# EasyEDA schematic SCH_Affordable-Quality-Slime-Project-(AQSP)_2024-12-04.json
TITLE: AQSP BMI270; REV: B1; Date: 2024-11-30; Sheet: 1/1; Drawn By: abillow; Company: Affordable Quality Slime Project
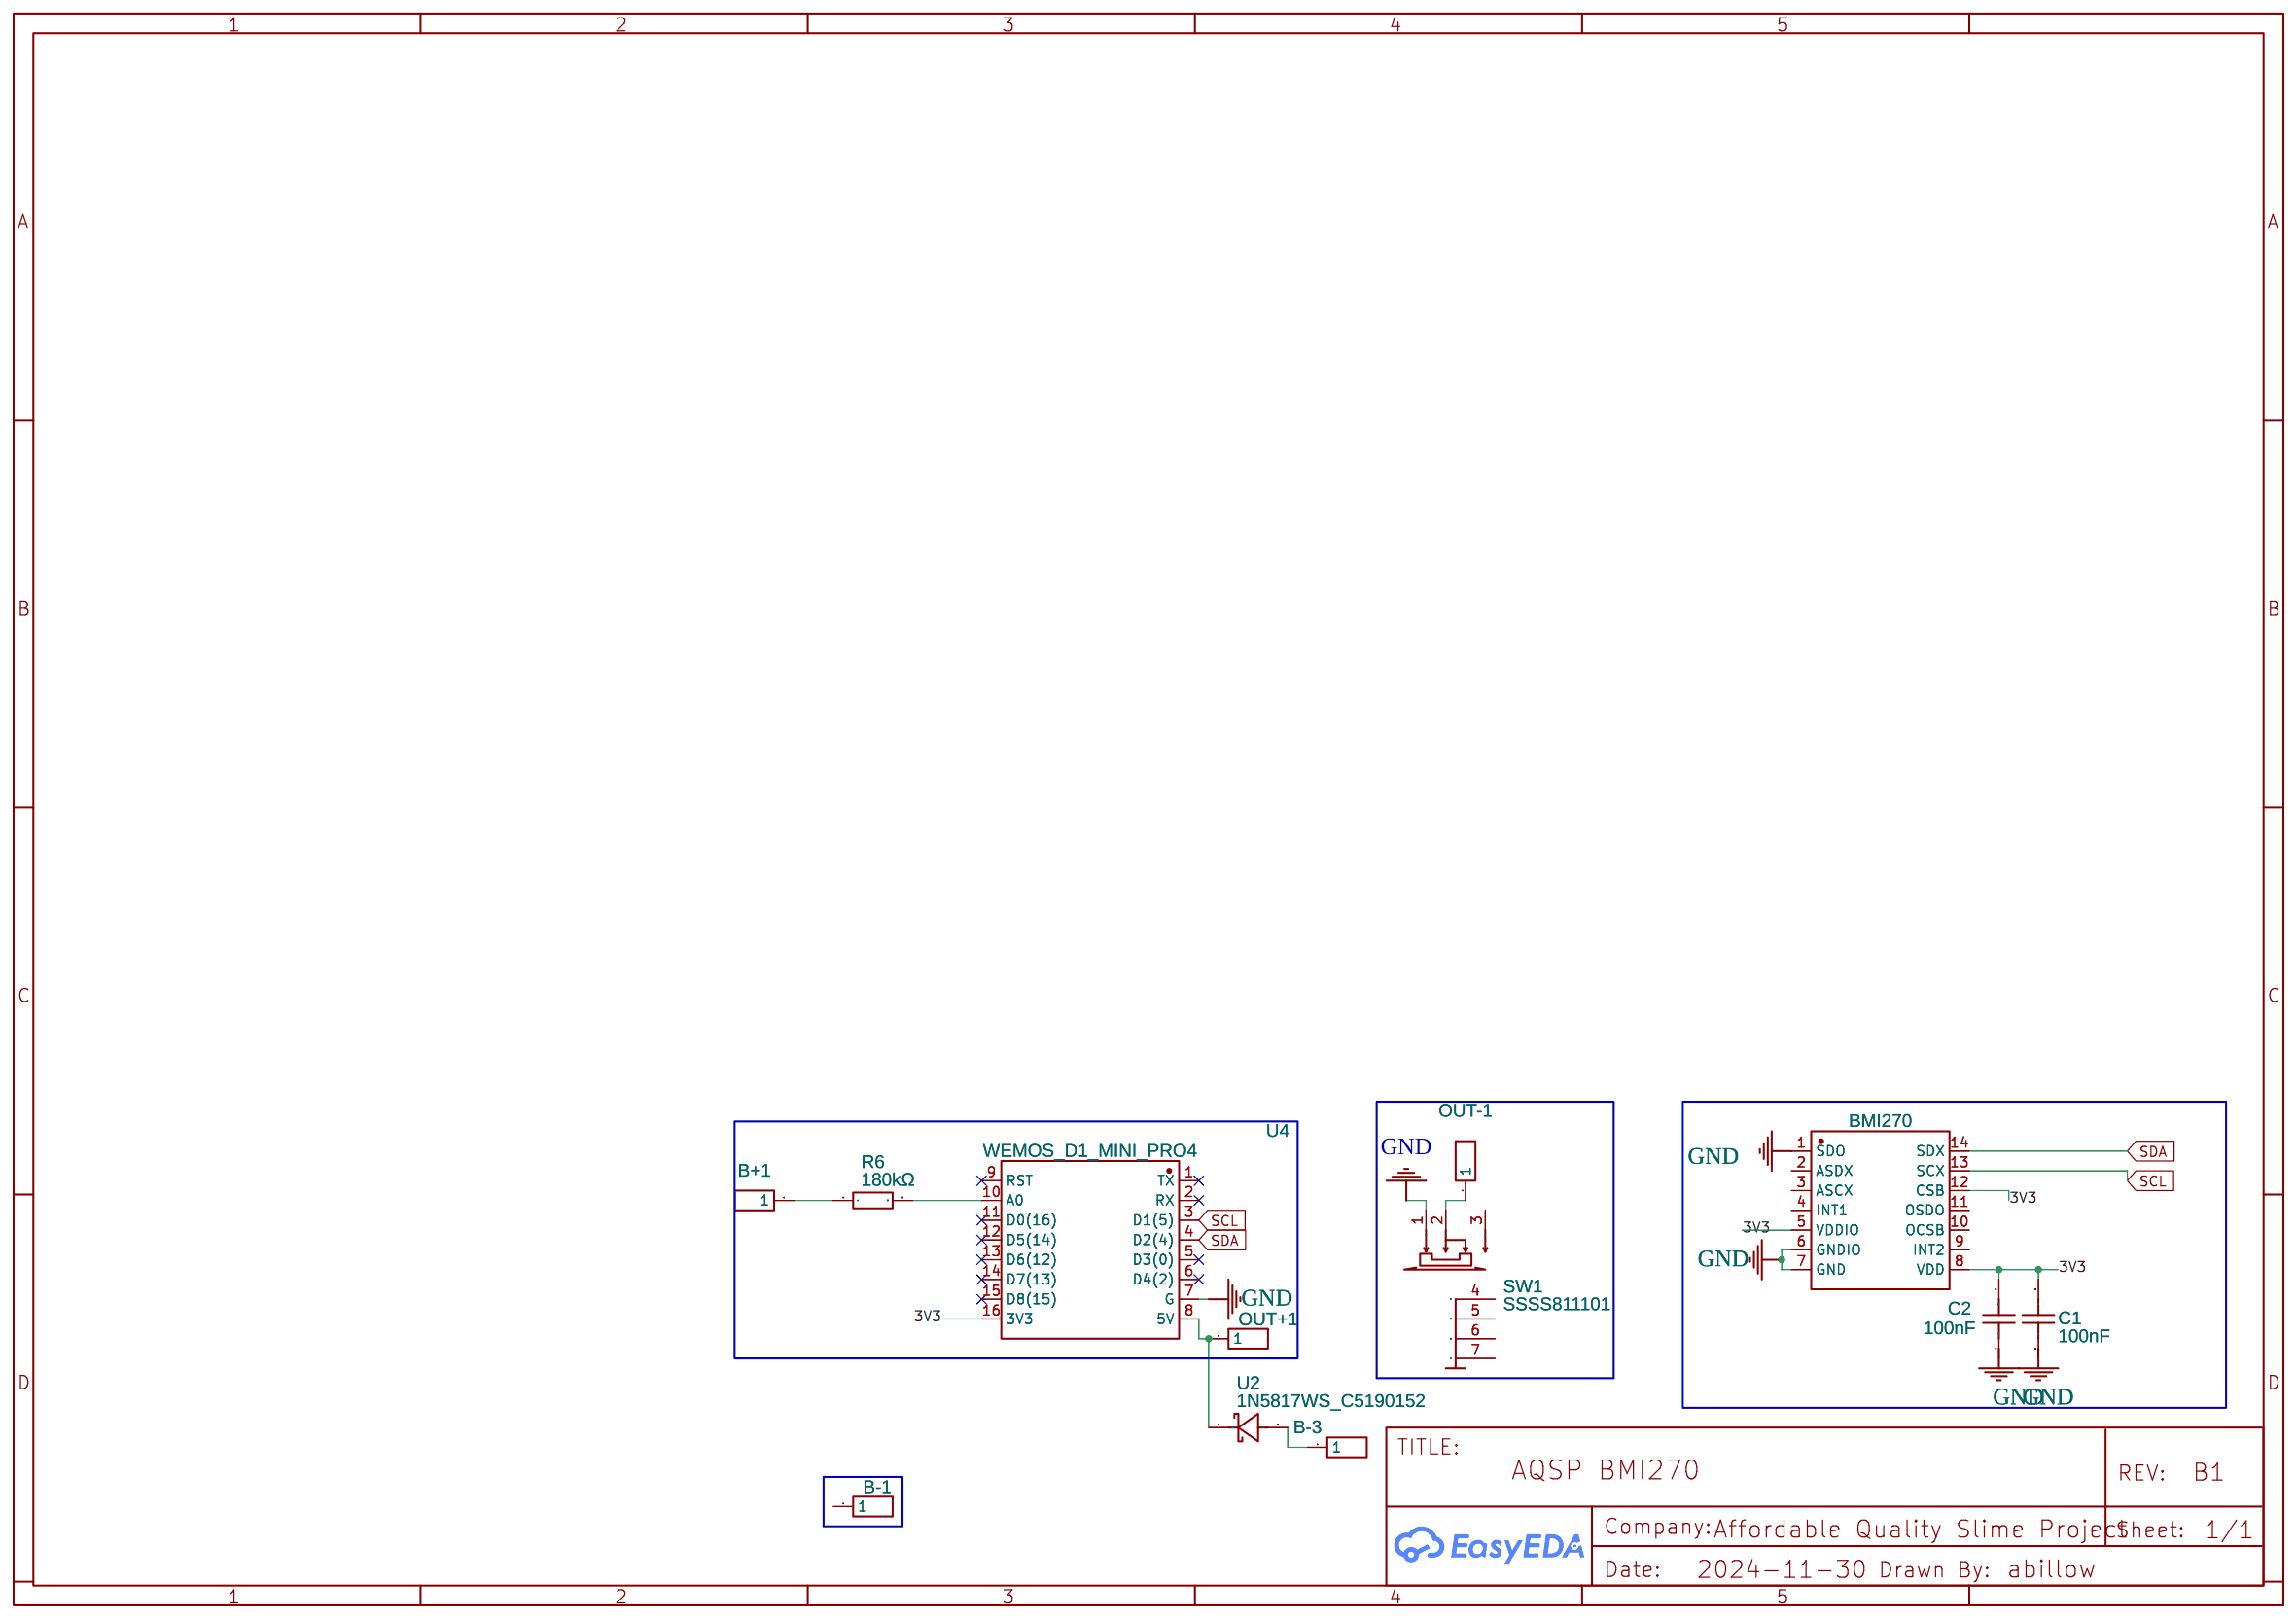
[diagram p0: schematic sheet]

## Parts
B+1  Header-Male-2.54_1x1  [HDR-1X1/2.54]
B-1  Header-Male-2.54_1x1  [HDR-1X1/2.54]
B-3  Header-Male-2.54_1x1  [HDR-1X1/2.54]
C1  100nF  [C0402]
C2  100nF  [C0402]
OUT+1  Header-Male-2.54_1x1  [HDR-1X1/2.54]
OUT-1  Header-Male-2.54_1x1  [HDR-1X1/2.54]
R6  180kΩ  [RES-TH_BD2.3-L6.5-P10.50-D0.5]
SW1  SSSS811101  [SW-SMD_SSSS811101]
U1  BMI270  [LGA-14_L3.0-W2.5-P0.50-BR]
U2  1N5817WS_C5190152  [SOD-323_L1.7-W1.3-LS2.6-RD-1]
U4  WEMOS_D1_MINI_PRO4  [DIP-16_WEMOS_D1_MINI_PRO4]

## Library data of the parts
B+1 B-1 B-3 OUT+1 OUT-1 = -: Supplier Part: C81276; Supplier: LCSC; Manufacturer: ReliaPro
C1 C2 = FN15X104K500PKG: Contributor: LCSC; Supplier: LCSC; Supplier Part: C525226; Manufacturer: PSA(信昌电陶); JLCPCB Part Class: Extended Part
R6 = MF1/4W-180KΩ±1% T52: Contributor: LCSC; Supplier: LCSC; Supplier Part: C119372; Manufacturer: CCO(千志电子); Manufacturer Part: MF1/4W-180KΩ±1% T; JLCPCB Part Class: Extended Part
SW1 = SSSS811101: Supplier: LCSC; Manufacturer: ALPSALPINE(阿尔卑斯阿尔派); Supplier Part: C109335; JLCPCB Part Class: Extended Part
U1 = BMI270: Contributor: LCSC; Supplier: LCSC; Supplier Part: C2836813; Manufacturer: Bosch(博世); JLCPCB Part Class: Extended Part
U2 = 1N5817WS_C5190152: Supplier: LCSC; Supplier Part: C5190152; Manufacturer: Hottech(合科泰); Manufacturer Part: 1N5817WS; JLCPCB Part Class: Extended Part; Contributor: lcsc
U4 = WEMOS_D1_MINI_PRO4: Contributor: LCSC; Supplier: LCSC; Supplier Part: C2837266; Manufacturer: null; Manufacturer Part: Wemos_D1_mini_Pro4; JLCPCB Part Class: Extended Part

## Nets
3V3: C1.2 C2.2 U1.5(VDDIO) U1.8(VDD) U1.12(CSB) U4.16(3V3)
GND: C1.1 C2.1 SW1.1 U1.1(SDO) U1.6(GNDIO) U1.7(GND) U4.7(G)
SCL: U1.13(SCX) U4.3(D1(5))
SDA: U1.14(SDX) U4.4(D2(4))
Net-(B+1-1): B+1.1 R6.1
Net-(B-3-1): B-3.1 U2.2(A)
Net-(OUT+1-1): OUT+1.1 U2.1(C) U4.8(5V)
Net-(OUT-1-1): OUT-1.1 SW1.2
Net-(R6-2): R6.2 U4.10(A0)

Not connected (* = marked no-connect by the designer): B-1 1; SW1 3 4 5 6 7; U1 2(ASDX) 3(ASCX) 4(INT1) 9(INT2) 10(OCSB) 11(OSDO); U4 1(TX)* 2(RX)* 5(D3(0))* 6(D4(2))* 9(RST)* 11(D0(16))* 12(D5(14))* 13(D6(12))* 14(D7(13))* 15(D8(15))*
